# Altium schematic sheet PSU_TPS73225_2V5.SchDoc
size A4
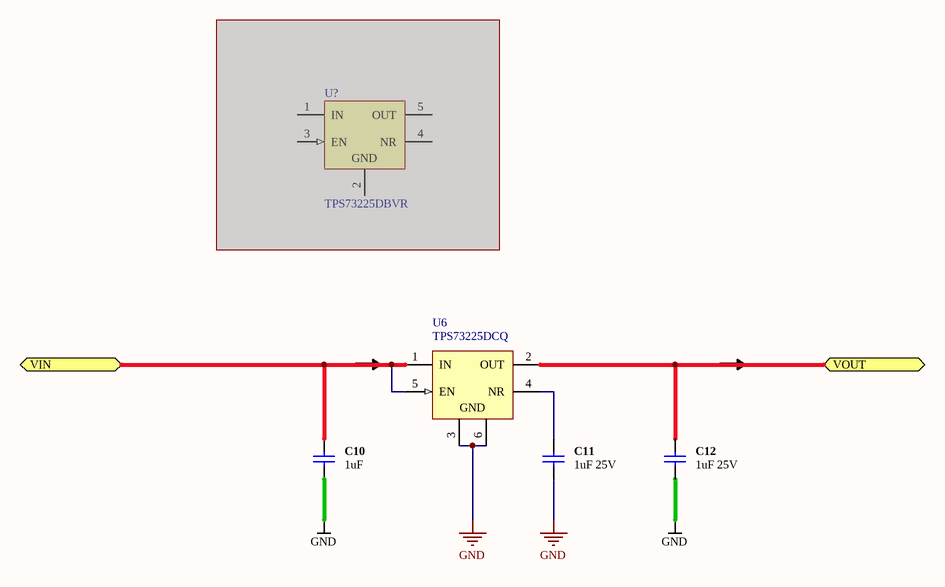
[diagram p0: PSU_TPS73225_2V5.SchDoc]

## Parts
C10  1uF  [CAPC3216-STAR]
C11  1uF 25V  [CAPC3216-STAR]
C12  1uF 25V  [CAPC3216-STAR]
U6  TPS73225DCQ  [TI-DCQ6_N]
U?  TPS73225DBVR  [TI-DBV5_N]  (masked out: inside a compile mask, not in the netlist)

## Ports
VIN, VOUT

## Nets
GND: C10.2 C11.2 C12.2 U6.3(GND) U6.6(GND)
VIN: C10.1 U6.1(IN) U6.5(EN) ; port VIN
VOUT: C12.1 U6.2(OUT) ; port VOUT
NetC11_1: C11.1 U6.4(NR)

## Library data of the parts
C10 = D-101-0027: Capacitor, Ceramic, 1uF 10% 25V 1206 (3216) X7R; Polarity: Non-Polarized; Rated Voltage: 10 V; Capacitance: 1 uF; Dielectric: X7R; Mounting Technology: Surface Mount; Status: Production; Technology: Ceramic; Tolerance: 10 %; Category: Capacitor
C11 C12 = D-101-0027: Capacitor, Ceramic, 1uF 10% 25V 1206 (3216) X7R; Polarity: Non-Polarized; Capacitance: 1 uF; Dielectric: X7R; Mounting Technology: Surface Mount; Rated Voltage: 25 V; Status: Production; Technology: Ceramic; Tolerance: 10 %; Category: Capacitor
U6 = TPS73225DCQ: Single Output Fast Transient Response LDO, 250 mA, Fixed 2.5 V Output, 1.7 to 5.5 V Input, with Reverse Current Protection, 6-pin SOT-223 (DCQ), -40 to 85 degC, Green (RoHS & no Sb/Br); Manufacturer: Texas Instruments; Accuracy(%): 1; Fixed Output Options(V): 2.5; Iout(Max)(A): 0.25; Iq(Typ)(mA): 0.4; SubFamily: Single Channel LDO; Vdo(Typ)(mV): 40; Vin(Max)(V): 5.5; Vin(Min)(V): 1.7; DatasheetVersion: SBVS037O; PackageVersion: 4202109/D; PackageReference: DCQ6; PackageDescription: 6-Pin Plastic Small Outline, Body 3.5 x 6.5 mm, Pitch 1.27 mm; Supplier 1: Digi-Key; Supplier Part Number 1: 296-34643-5-ND; Supplier 2: Newark; Supplier Part Number 2: 01J0991; Supplier 3: Mouser; Supplier Part Number 3: 595-TPS73225DCQ; Eco-Plan: Green (RoHS & no Sb/Br); Vout Adj(Max)(V): 2.5; Vout Adj(Min)(V): 2.5; Mounting Technology: Surface Mount; PartNumber: TPS73225DCQ; ComponentLink1Description: Manufacturer URL; ComponentLink1URL: http://www.ti.com/; ComponentLink2Description: Datasheet; ComponentLink2URL: http://www.ti.com/general/docs/lit/getliterature.tsp?genericPartNumber=TPS73225&fileType=pdf; ComponentLink3Description: Package Specification; ComponentLink3URL: http://www.ti.com/litv/pdf/mpds098c
U? = TPS73225DBVR: Single Output Fast Transient Response LDO, 250 mA, Fixed 2.5 V Output, 1.7 to 5.5 V Input, with Reverse Current Protection, 5-pin SOT-23 (DBV), -40 to 85 degC, Green (RoHS & no Sb/Br); Manufacturer: Texas Instruments; Accuracy(%): 1; Fixed Output Options(V): 2.5; Iout(Max)(A): 0.25; Iq(Typ)(mA): 0.4; SubFamily: Single Channel LDO; Vdo(Typ)(mV): 40; Vin(Max)(V): 5.5; Vin(Min)(V): 1.7; DatasheetVersion: SBVS037O; PackageVersion: 4073253-4/K; PackageReference: DBV5; PackageDescription: 5-Pin Plastic Small Outline, Body 1.60 Ã— 2.90 mm, Pitch 0.95 mm; Supplier 1: Digi-Key; Supplier Part Number 1: TPS73225DBVR-ND; Supplier 2: Newark; Supplier Part Number 2: 87H2963; Supplier 3: Mouser; Supplier Part Number 3: 595-TPS73225DBVR; Eco-Plan: Green (RoHS & no Sb/Br); Vout Adj(Max)(V): 2.5; Vout Adj(Min)(V): 2.5; Mounting Technology: Surface Mount; Code_JEDEC: MO-178; PartNumber: TPS73225DBVR; ComponentLink1Description: Manufacturer URL; ComponentLink1URL: http://www.ti.com/; ComponentLink2Description: Datasheet; ComponentLink2URL: http://www.ti.com/general/docs/lit/getliterature.tsp?genericPartNumber=TPS73225&fileType=pdf; ComponentLink3Description: Package Specification; ComponentLink3URL: http://www.ti.com/litv/pdf/mpds018i